# Altium schematic sheet USBPowerMux.SchDoc
size A; SheetNumber: 2; SheetTotal: 2; SPICEModelCacheGCPYIVAD: <root> / <DocumentId>GCPYIVAD</DocumentId> / <CacheFrame Number="0"> / <Model Name="inv_delay_basic_gen" Kind="CKT"> / <Text>*$ / .SUBCKT INV_DELAY_BASIC_GEN A  Y PARAMS: VDD=1 VSS=0 VTHRESH=0.5 DELAY = 10n / E_ABMGATE1    YINT1 0 VALUE {{IF(V(A) &gt; {VTHRESH} , / + {VDD},{VSS})}} / RINT YINT1 YINT2 1 / CINT YINT2 0 {DELAY*1.3} / E_ABMGATE2    YINT3 0 VALUE {{IF(V(YINT2) &gt; {VTHRESH} , / + {VSS},{VDD})}} / RINT2 YINT3 Y 1 / CINT2 Y 0 1n / .ENDS INV_DELAY_BASIC_GEN</Text> / </Model> / <Model Name="pmos01" Kind="MDL"> / <Text>*$ / .model PMOS01 pmos / + vto=-0.69 / + kp=1000 / + lambda=0.001</Text> / </Model> / <Model Name="dd" Kind="MDL"> / <Text>*$ / .model DD d / + is=1e-015 / + n=0.01 / + tt=1e-011</Text> / </Model> / <Model Name="rvar" Kind="CKT"> / <Text>*$ / .subckt rvar 101 102 201 202 Params: Rref=1 / rin 201 202 1G / r 301 0 {rref} / fcopy 0 301 vsense 1 / eout 101 106 poly(2) 201 202 301 0 0 0 0 0 1 / vsense 106 102 0 / .ends</Text> / </Model> / <Model Name="and2_basic_gen" Kind="CKT"> / <Text>*$ / .SUBCKT AND2_BASIC_GEN A B Y PARAMS: VDD=1 VSS=0 VTHRESH=0.5 / E_ABMGATE    YINT 0 VALUE {{IF(V(A) &gt; {VTHRESH}  &amp; / + V(B) &gt; {VTHRESH},{VDD},{VSS})}} / RINT YINT Y 1 / CINT Y 0 1n / .ENDS AND2_BASIC_GEN</Text> / </Model> / <Model Name="or2_basic_gen" Kind="CKT"> / <Text>*$ / .SUBCKT OR2_BASIC_GEN A B Y PARAMS: VDD=1 VSS=0 VTHRESH=0.5 / E_ABMGATE    YINT 0 VALUE {{IF(V(A) &gt; {VTHRESH}  | / + V(B) &gt; {VTHRESH},{VDD},{VSS})}} / RINT YINT Y 1 / CINT Y 0 1n / .ENDS OR2_BASIC_GEN</Text> / </Model> / <Model Name="channel_1_u1_s2" Kind="CKT"> / <Text>*$ / .subckt CHANNEL_1_U1_S2 1 2 3 4 / S_U1_S2         3 4 1 2 _U1_S2 / RS_U1_S2         1 2 1G / .MODEL         _U1_S2 VSWITCH Roff=1m Ron=1G Voff=0.2 Von=0.8 / .ends CHANNEL_1_U1_S2</Text> / </Model> / <Model Name="channel_1_u1_s1" Kind="CKT"> / <Text>*$ / .subckt CHANNEL_1_U1_S1 1 2 3 4 / S_U1_S1         3 4 1 2 _U1_S1 / RS_U1_S1         1 2 1G / .MODEL         _U1_S1 VSWITCH Roff=1m Ron=1G Voff=0.1 Von=0.8 / .ends CHANNEL_1_U1_S1</Text> / </Model> / <Model Name="buf_delay_basic_gen" Kind="CKT"> / <Text>*$ / .SUBCKT BUF_DELAY_BASIC_GEN A  Y PARAMS: VDD=1 VSS=0 VTHRESH=0.5 DELAY = 10n / E_ABMGATE1    YINT1 0 VALUE {{IF(V(A) &gt; {VTHRESH} , / + {VDD},{VSS})}} / RINT YINT1 YINT2 1 / CINT YINT2 0 {DELAY*1.3} / E_ABMGATE2    YINT3 0 VALUE {{IF(V(YINT2) &gt; {VTHRESH} , / + {VDD},{VSS})}} / RINT2 YINT3 Y 1 / CINT2 Y 0 1n / .ENDS BUF_DELAY_BASIC_GEN</Text> / </Model> / <Model Name="comphys_basic_gen" Kind="CKT"> / <Text>*$ / .SUBCKT COMPHYS_BASIC_GEN INP INM HYS OUT PARAMS: VDD=1 VSS=0 VTHRESH=0.5 / EIN INP1 INM1 INP INM 1 / EHYS INP1 INP2 VALUE { IF( V(1) &gt; {VTHRESH},-V(HYS),0) } / EOUT OUT 0 VALUE { IF( V(INP2)&gt;V(INM1), {VDD} ,{VSS}) } / R1 OUT 1 1 / C1 1 0 5n / RINP1 INP1 0 1K / .ENDS COMPHYS_BASIC_GEN</Text> / </Model> / <Model Name="mode_pr1_st_u3_s1" Kind="CKT"> / <Text>*$ / .subckt MODE_PR1_ST_U3_S1 1 2 3 4 / S_U3_S1         3 4 1 2 _U3_S1 / RS_U3_S1         1 2 1G / .MODEL         _U3_S1 VSWITCH Roff=53.3Meg Ron=100 Voff=0.8V Von=0.2V / .ends MODE_PR1_ST_U3_S1</Text> / </Model> / <Model Name="inv_basic_gen" Kind="CKT"> / <Text>*$ / .SUBCKT INV_BASIC_GEN A  Y PARAMS: VDD=1 VSS=0 VTHRESH=0.5 / E_ABMGATE    YINT 0 VALUE {{IF(V(A) &gt; {VTHRESH} , / + {VSS},{VDD})}} / RINT YINT Y 1 / CINT Y 0 1n / .ENDS INV_BASIC_GEN</Text> / </Model> / <Model Name="buf_basic_gen" Kind="CKT"> / <Text>*$ / .SUBCKT BUF_BASIC_GEN A  Y PARAMS: VDD=1 VSS=0 VTHRESH=0.5 / E_ABMGATE    YINT 0 VALUE {{IF(V(A) &gt; {VTHRESH} , / + {VDD},{VSS})}} / RINT YINT Y 1 / CINT Y 0 1n / .ENDS BUF_BASIC_GEN</Text> / </Model> / <Model Name="comp_basic_gen" Kind="CKT"> / <Text>*$ / .SUBCKT COMP_BASIC_GEN INP INM Y PARAMS: VDD=1 VSS=0 VTHRESH=0.5 / E_ABM Yint 0 VALUE {IF (V(INP) &gt; / + V(INM), {VDD},{VSS})} / R1 Yint Y 1 / C1 Y 0 1n / .ENDS COMP_BASIC_GEN</Text> / </Model> / <Model Name="srlatchrhp_basic_gen" Kind="CKT"> / <Text>*$ / .SUBCKT SRLATCHRHP_BASIC_GEN S R Q QB PARAMS: VDD=1 VSS=0 VTHRESH=0.5 / GQ 0 Qint VALUE = {IF(V(R) &gt; {VTHRESH},-5,IF(V(S)&gt;{VTHRESH},5, 0))} / CQint Qint 0 1n / RQint Qint 0 1000MEG / D_D10 Qint MY5 D_D1 / V1 MY5 0 {VDD} / D_D11 MYVSS Qint D_D1 / V2 MYVSS 0 {VSS} / EQ Qqq 0 Qint 0 1 / X3 Qqq Qqqd1 BUF_BASIC_GEN PARAMS: VDD={VDD} VSS={VSS} VTHRESH={VTHRESH} / RQq Qqqd1 Q 1 / EQb Qbr 0 VALUE = {IF( V(Q) &gt; {VTHRESH}, {VSS},{VDD})} / RQb Qbr QB 1 / Cdummy1 Q 0 1n / Cdummy2 QB 0 1n / .IC V(Qint) {VSS} / .model d_d1 d / + is=1e-015 / + tt=1e-011 / + rs=0.05 / + n=0.01 / .ENDS SRLATCHRHP_BASIC_GEN</Text> / <Dependency>0\buf_basic_gen</Dependency> / </Model> / <Model Name="and3_basic_gen" Kind="CKT"> / <Text>*$ / .SUBCKT AND3_BASIC_GEN A B C Y PARAMS: VDD=1 VSS=0 VTHRESH=0.5 / E_ABMGATE    YINT 0 VALUE {{IF(V(A) &gt; {VTHRESH}  &amp; / + V(B) &gt; {VTHRESH} &amp; / + V(C) &gt; {VTHRESH},{VDD},{VSS})}} / RINT YINT Y 1 / CINT Y 0 1n / .ENDS AND3_BASIC_GEN</Text> / </Model> / <Model Name="nor2_basic_gen" Kind="CKT"> / <Text>*$ / .SUBCKT NOR2_BASIC_GEN A B Y PARAMS: VDD=1 VSS=0 VTHRESH=0.5 / E_ABMGATE    YINT 0 VALUE {{IF(V(A) &gt; {VTHRESH}  | / + V(B) &gt; {VTHRESH},{VSS},{VDD})}} / RINT YINT Y 1 / CINT Y 0 1n / .ENDS NOR2_BASIC_GEN</Text> / </Model> / <Model Name="or3_basic_gen" Kind="CKT"> / <Text>*$ / .SUBCKT OR3_BASIC_GEN A B C Y PARAMS: VDD=1 VSS=0 VTHRESH=0.5 / E_ABMGATE    YINT 0 VALUE {{IF(V(A) &gt; {VTHRESH}  | / + V(B) &gt; {VTHRESH} | / + V(C) &gt; {VTHRESH},{VDD},{VSS})}} / RINT YINT Y 1 / CINT Y 0 1n / .ENDS OR3_BASIC_GEN</Text> / </Model> / <Model Name="one_shot" Kind="CKT"> / <Text>*$ / .SUBCKT ONE_SHOT IN OUT PARAMS:  T=100 / S_S1         MEAS 0 RESET2 0 S1 / E_ABM1         CH 0 VALUE { IF( V(IN)&gt;0.5 | V(OUT)&gt;0.5,1,0)    } / R_R2         RESET2 RESET  0.1 / E_ABM3         OUT 0 VALUE { IF( V(MEAS)&lt;0.5 &amp; V(CH)&gt;0.5,1,0)    } / R_R1         MEAS CH  {T} / C_C2         0 RESET2  1.4427N / C_C1         0 MEAS  1.4427N / E_ABM2         RESET 0 VALUE { IF(V(CH)&lt;0.5,1,0)    } / .MODEL S1 VSWITCH / + ROFF=1E+009 / + RON=1 / + VOFF=0.25 / + VON=0.75 / .ENDS ONE_SHOT</Text> / </Model> / <Model Name="channel_1_u7_s2" Kind="CKT"> / <Text>*$ / .subckt CHANNEL_1_U7_S2 1 2 3 4 / S_U7_S2         3 4 1 2 _U7_S2 / RS_U7_S2         1 2 1G / .MODEL         _U7_S2 VSWITCH Roff=1m Ron=1G Voff=0.2 Von=0.8 / .ends CHANNEL_1_U7_S2</Text> / </Model> / <Model Name="channel_1_u7_s1" Kind="CKT"> / <Text>*$ / .subckt CHANNEL_1_U7_S1 1 2 3 4 / S_U7_S1         3 4 1 2 _U7_S1 / RS_U7_S1         1 2 1G / .MODEL         _U7_S1 VSWITCH Roff=1m Ron=1G Voff=0.1 Von=0.8 / .ends CHANNEL_1_U7_S1</Text> / </Model> / <Model Name="tps2116_trans" Kind="CKT"> / <Text>*$ / * TPS2116 / ***************************************************************************** / * (C) Copyright 2021 Texas Instruments Incorporated. All rights reserved. / ***************************************************************************** / ** This model is designed as an aid for customers of Texas Instruments. / ** TI and its licensors and suppliers make no warranties, either expressed / ** or implied, with respect to this model, including the warranties of / ** merchantability or fitness for a particular purpose.  The model is / ** provided solely on an "as is" basis.  The entire risk as to its quality / ** and performance is with the customer / ***************************************************************************** / * / * This model is subject to change without notice. Texas Instruments / * Incorporated is not responsible for updating this model. / * / ***************************************************************************** / * / ** Released by: Texas Instruments Inc. / * Part: TPS2116 / * Date: 05MAY2021 / * Model Type: TRANSIENT / * Simulator: PSPICE / * Simulator Version: 17.2-2016 S074 / * EVM Order Number: TPS2116EVM / * EVM Users Guide: PSIL122 / * Datasheet: SLVSFG1 â€“ AUGUST 2019 / * / * Model Version: Final 1.10 / * / ***************************************************************************** / * / * Updates: / * / * Final 1.10 / * Following modifications are done in comparision to TPS2116 ver 1.0. / * 1. Diode mode functionality is removed / * 2. Switchover time values are updated / * 3. RON values are updated / * 4. Quiescent and standby current values are updated. Shutdown currents are removed / * 5. Soft-start and fast rise blocks are modified / * / * Final 1.00 / * Release to Web. / * / ***************************************************************************** / * / * Model Usage Notes: / * A. Features have been modelled / *	1. 	Turn-on switching characteristic / *	2. 	Switch over characteristic- Priority/Manual mode / *	3. 	Reverse current blocking / *	4. 	Quiescent Current and Standby Current / *	5. 	Ron Variation with VIN / *   6.  Status pin(ST) behaviour / * / * B. Features have not been modelled / *	1.  Temperature dependent characteristics / * / ***************************************************************************** / .SUBCKT  TPS2116_TRANS  GND MODE PR1 ST VIN1 VIN2 VOUT_0 VOUT_1 / D_U1_D8         VOUT_0 U1_SOURCE DD / D_U1_D9         GND U1_GATE_1 DD / D_U1_D7         U1_N16177224 U1_SOURCE DD / M_U1_HFET_1         VOUT_0 U1_GATE_1 U1_SOURCE U1_CLAMP PMOS01 / D_U1_D6         U1_GATE_1 U1_CLAMP DD / G_U1_G1         U1_CLAMP U1_GATE_1 U1_BFET_EN 0 1m / G_U1_G8         U1_GATE_1 GND TABLE { V(U1_N16194620, 0) } / + ( (0,0)(1.8,208n)(3.3,264n)(5.0,306n) ) / E_U1_ABM16         U1_N16194620 0 VALUE { IF(V(EN_GATE1) &gt; 0.5, V(VIN1),0)    } / C_U1_C4         VOUT_0 U1_GATE_1  130p  TC=0,0 / G_U1_G11         U1_GATE_1 GND FAST_RISE_1 0 100u / E_U1_ABM17         U1_CLAMP 0 VALUE { IF((V(VOUT_0) / + &gt;V(VIN1)),V(VOUT_0),V(VIN1))   } / X_U1_U7         U1_N16680056 U1_N16177224 U1_ON_RES1 0 RVAR PARAMS:  RREF=1 / X_U1_U59         U1_N16678010 EN_CH1 U1_N16678042 AND2_BASIC_GEN PARAMS: VDD=1 / +  VSS=0 VTHRESH=500E-3 / X_U1_S2    U1_BFET_EN 0 U1_N16177224 U1_SOURCE CHANNEL_1_U1_S2 / V_U1_V2         U1_N16184706 0 25m / V_U1_V1         U1_N16184645 VIN1_INT 42m / X_U1_U57         FAST_RISE_1 EN_GATE1 U1_N16678010 OR2_BASIC_GEN PARAMS: VDD=1 / +  VSS=0 VTHRESH=500E-3 / X_U1_S1    RCB_1 0 VIN1 U1_N16680056 CHANNEL_1_U1_S1 / E_U1_E2         U1_N16679358 0 TABLE { V(VIN1_INT, 0) } / + ( (0,0)(1.6,39m)(1.8,38m)(3.3,38m)(4,35m) ) / X_U1_U58         U1_N16678042 U1_BFET_EN INV_DELAY_BASIC_GEN PARAMS: VDD=1 / +  VSS=0 VTHRESH=0.5 DELAY=200n / C_U1_C11         0 U1_ON_RES1  1n / X_U1_U3         U1_N16185653 RCB_1 BUF_DELAY_BASIC_GEN PARAMS: VDD=1 VSS=0 / +  VTHRESH=0.5 DELAY=2u / X_U1_U2         VOUT_INT U1_N16184645 U1_N16184706 U1_N16185653 / +  COMPHYS_BASIC_GEN PARAMS: VDD=1 VSS=0 VTHRESH=0.5 / R_U1_R6         U1_N16679358 U1_ON_RES1  10 TC=0,0 / R_R1         VOUT_1 VOUT_0  1m TC=0,0 / X_U3_U8         U3_MODE_SEL U3_N16179076 U3_N16690215 AND2_BASIC_GEN PARAMS: / +  VDD=1 VSS=0 VTHRESH=500E-3 / V_U3_V3         U3_N16178390 0 1 / V_U3_V4         U3_N16178468 0 22m / X_U3_U1         MODE_INT U3_N16691574 U3_N16178252 U3_MODE_SEL / +  COMPHYS_BASIC_GEN PARAMS: VDD=1 VSS=0 VTHRESH=0.5 / X_U3_U2         PR1_INT U3_N16178390 U3_N16178468 U3_PR1_SEL COMPHYS_BASIC_GEN / +  PARAMS: VDD=1 VSS=0 VTHRESH=0.5 / V_U3_V2         U3_N16178252 0 100m / D_U3_D8         0 U3_N16684426 DD / X_U3_S1    U3_N16686667 0 ST 0 MODE_PR1_ST_U3_S1 / X_U3_U73         EN_CH2 U3_N16683632 INV_BASIC_GEN PARAMS: VDD=1 VSS=0 / +  VTHRESH=500E-3 / X_U3_U75         U3_N16684426 U3_SWITCH_OVER_DELAY_2 BUF_BASIC_GEN PARAMS: / +  VDD=1 VSS=0 VTHRESH=0.5 / E_U3_ABM7         U3_N166830931 0 VALUE { IF(V(U3_N16683632) &gt; 0.5, / +  V(VIN1_INT),0)    } / V_U3_V6         U3_N16181467 0 1.59 / E_U3_ABM8         U3_N166843121 0 VALUE { IF(V(U3_N16684336) &gt; 0.5, / +  V(VIN2_INT),0)    } / C_U3_C5         0 U3_N16683195  1n IC=0 / C_U3_C4         0 U3_N16683157  1n / X_U3_U18         VIN1_INT U3_N16181467 IN1_OK COMP_BASIC_GEN PARAMS: VDD=1 / +  VSS=0 VTHRESH=0.5 / X_U3_U14         U3_N16686181 U3_N16686667 BUF_DELAY_BASIC_GEN PARAMS: VDD=1 / +  VSS=0 VTHRESH=0.5 DELAY=5u / R_U3_R3         U3_N166830931 U3_N16683157  10 TC=0,0 / X_U3_U78         EN_CH1 U3_N16686162 U3_N16686181 N16686185 / +  SRLATCHRHP_BASIC_GEN PARAMS: VDD=1 VSS=0 VTHRESH=0.5 / C_U3_C7         0 U3_N16684426  1n IC=0 / D_U3_D5         U3_N16683195 U3_N16683065 DD / C_U3_C6         0 U3_N16684388  1n / X_U3_U24         U3_N16689992 IN1_OK U3_SWITCH_OVER_DELAY_1 EN_CH1 / +  AND3_BASIC_GEN PARAMS: VDD=1 VSS=0 VTHRESH=500E-3 / G_U3_G12         U3_N16683195 0 EN_CH2 0 100m / R_U3_R4         U3_N166843121 U3_N16684388  10 TC=0,0 / V_U3_V14         U3_N16684262 0 0.6 / X_U3_U19         VIN2_INT U3_N16181621 IN2_OK COMP_BASIC_GEN PARAMS: VDD=1 / +  VSS=0 VTHRESH=0.5 / D_U3_D7         U3_N16684426 U3_N16684262 DD / G_U3_G11         U3_N16683065 U3_N16683195 TABLE { V(U3_N16683157, 0) } / + ( (0,0) (1.8,30u) (3.3,100u)(5,80u) ) / X_U3_U27         U3_N16690215 IN2_OK U3_SWITCH_OVER_DELAY_2 EN_CH2 / +  AND3_BASIC_GEN PARAMS: VDD=1 VSS=0 VTHRESH=500E-3 / G_U3_G14         U3_N16684426 0 EN_CH1 0 100m / V_U3_V13         U3_N16683065 0 0.6 / X_U3_U87         IN2_OK EN_CH1 U3_N16688062 NOR2_BASIC_GEN PARAMS: VDD=1 VSS=0 / +  VTHRESH=500E-3 / G_U3_G13         U3_N16684262 U3_N16684426 TABLE { V(U3_N16684388, 0) } / + ( (0,0) (1.8,30u) (3.3,100u)(5,80u) ) / D_U3_D6         0 U3_N16683195 DD / X_U3_U72         U3_N16683195 U3_SWITCH_OVER_DELAY_1 BUF_BASIC_GEN PARAMS: / +  VDD=1 VSS=0 VTHRESH=0.5 / V_U3_V7         U3_N16181621 0 1.59 / X_U3_U74         EN_CH1 U3_N16684336 INV_BASIC_GEN PARAMS: VDD=1 VSS=0 / +  VTHRESH=500E-3 / V_U3_V15         U3_N16691368 0 0.1 / V_U3_V1         U3_N16691574 0 1 / X_U3_U90         U3_PR1_SEL U3_N16179076 INV_BASIC_GEN PARAMS: VDD=1 VSS=0 / +  VTHRESH=500E-3 / X_U3_U91         EN_CH2 RCB_1 U3_N16688062 U3_N16686162 OR3_BASIC_GEN PARAMS: / +  VDD=1 VSS=0 VTHRESH=500E-3 / X_U3_U89         U3_MODE_SEL U3_PR1_SEL U3_N16689992 AND2_BASIC_GEN PARAMS: / +  VDD=1 VSS=0 VTHRESH=500E-3 / V_U3_V16         U3_N16693410 0 1 / E_U3_E1         U3_N16691252 0 VIN1_INT VIN2_INT 1 / X_U3_U92         U3_N16691252 U3_N16691368 U3_N16693410 CH1_SEL / +  COMPHYS_BASIC_GEN PARAMS: VDD=1 VSS=0 VTHRESH=0.5 / E_E1         VIN1_INT 0 VIN1 GND 1 / E_E2         VIN2_INT 0 VIN2 GND 1 / E_E3         MODE_INT 0 MODE GND 1 / E_E4         PR1_INT 0 PR1 GND 1 / E_E5         VOUT_INT 0 VOUT_0 GND 1 / V_U4_V14         U4_N16719653 0 1m / X_U4_U101         U4_N16719969 U4_N16719905 ONE_SHOT PARAMS:  T=100 / C_U4_C1         0 U4_N16720367  1u IC=0 / V_U4_V15         U4_N16719361 0 1 / X_U4_U102         U4_N16719811 U4_N16719905 U4_N16719659 OR2_BASIC_GEN PARAMS: / +  VDD=1 VSS=0 VTHRESH=500E-3 / X_U4_U86         EN_CH1 U4_N16719805 INV_BASIC_GEN PARAMS: VDD=1 VSS=0 / +  VTHRESH=500E-3 / E_U4_ABM6         U4_N167201631 0 VALUE { IF(V(U4_POWER_UP_1) &gt; 0.5, / +  V(VIN1_INT),0)    } / V_U4_V16         U4_N16720095 0 0.51 / G_U4_G12         U4_N16720339 0 U4_N16720719 0 100m / G_U4_G3         U4_N16720099 U4_N16720367 TABLE { V(U4_N16720301, 0) } / + ( (0,0) (1.8,600u) (3.3,725u)(5,1m) ) / D_U4_D4         0 U4_N16720367 DD / X_U4_U97         EN_CH1 U4_N16719555 U4_POWER_UP_1 AND2_BASIC_GEN PARAMS: VDD=1 / +  VSS=0 VTHRESH=500E-3 / C_U4_C7         0 U4_N16720283  1n / V_U4_V5         U4_N16720099 0 0.51 / X_U4_U88         U4_N16719805 U4_N16719811 ONE_SHOT PARAMS:  T=100 / R_U4_R5         U4_N167201451 U4_N16720283  10 TC=0,0 / X_U4_U91         U4_N16719429 U4_N16719659 U4_N16719555 U4_N16719669 / +  SRLATCHRHP_BASIC_GEN PARAMS: VDD=1 VSS=0 VTHRESH=0.5 / X_U4_U104         U4_N16719669 EN_CH2 FAST_RISE_2 AND2_BASIC_GEN PARAMS: VDD=1 / +  VSS=0 VTHRESH=500E-3 / G_U4_G10         U4_N16720367 0 U4_N16720759 0 100m / D_U4_D5         U4_N16720339 U4_N16720095 DD / X_U4_U95         U4_N16719669 EN_CH1 FAST_RISE_1 AND2_BASIC_GEN PARAMS: VDD=1 / +  VSS=0 VTHRESH=500E-3 / X_U4_U105         U4_N16720339 EN_GATE2 BUF_BASIC_GEN PARAMS: VDD=1 VSS=0 / +  VTHRESH=0.5 / X_U4_U92         U4_N16719361 VOUT_INT U4_N16719367 COMP_BASIC_GEN PARAMS: / +  VDD=1 VSS=0 VTHRESH=0.5 / X_U4_U94         U4_N16719373 U4_N16719451 U4_N16719429 OR2_BASIC_GEN PARAMS: / +  VDD=1 VSS=0 VTHRESH=500E-3 / X_U4_U84         VOUT_INT U4_N16719653 U4_N16719601 COMP_BASIC_GEN PARAMS: / +  VDD=1 VSS=0 VTHRESH=0.5 / C_U4_C8         0 U4_N16720339  1u IC=0 / G_U4_G11         U4_N16720095 U4_N16720339 TABLE { V(U4_N16720283, 0) } / + ( (0,0) (1.8,600u) (3.3,725u)(5,1m) ) / C_U4_C3         0 U4_N16720301  1n / X_U4_U106         EN_CH2 U4_N16720719 INV_BASIC_GEN PARAMS: VDD=1 VSS=0 / +  VTHRESH=500E-3 / X_U4_U100         EN_CH2 U4_N16719969 INV_BASIC_GEN PARAMS: VDD=1 VSS=0 / +  VTHRESH=500E-3 / X_U4_U43         U4_N16720367 EN_GATE1 BUF_BASIC_GEN PARAMS: VDD=1 VSS=0 / +  VTHRESH=0.5 / D_U4_D6         0 U4_N16720339 DD / X_U4_U93         U4_N16719367 U4_N16719373 ONE_SHOT PARAMS:  T=100 / X_U4_U103         EN_CH2 U4_N16719555 U4_POWER_UP_2 AND2_BASIC_GEN PARAMS: / +  VDD=1 VSS=0 VTHRESH=500E-3 / D_U4_D3         U4_N16720367 U4_N16720099 DD / X_U4_U99         EN_CH1 U4_N16720759 INV_BASIC_GEN PARAMS: VDD=1 VSS=0 / +  VTHRESH=500E-3 / R_U4_R2         U4_N167201631 U4_N16720301  10 TC=0,0 / E_U4_ABM7         U4_N167201451 0 VALUE { IF(V(U4_POWER_UP_2) &gt; 0.5, / +  V(VIN2_INT),0)    } / X_U4_U85         U4_N16719601 U4_N16719451 ONE_SHOT PARAMS:  T=100 / X_U6_U1         EN_CH1 CH1_SEL U6_N16669985 AND2_BASIC_GEN PARAMS: VDD=1 VSS=0 / +  VTHRESH=500E-3 / G_U6_G7         VIN1 GND U6_N16672314 0 1.32u / X_U6_U9         CH1_SEL U6_N16671249 INV_BASIC_GEN PARAMS: VDD=1 VSS=0 / +  VTHRESH=500E-3 / X_U6_U12         CH1_SEL U6_N16672366 INV_BASIC_GEN PARAMS: VDD=1 VSS=0 / +  VTHRESH=500E-3 / X_U6_U5         EN_CH2 U6_N16671900 U6_N16671860 AND2_BASIC_GEN PARAMS: VDD=1 / +  VSS=0 VTHRESH=500E-3 / G_U6_G6         VIN2 GND U6_N16671209 0 1.35u / G_U6_G8         VIN1 GND U6_N16672326 0 0.3u / G_U6_G3         VIN1 GND U6_N16671848 0 1.1u / X_U6_U6         CH1_SEL U6_N16671900 INV_BASIC_GEN PARAMS: VDD=1 VSS=0 / +  VTHRESH=500E-3 / X_U6_U3         CH1_SEL U6_N16670318 INV_BASIC_GEN PARAMS: VDD=1 VSS=0 / +  VTHRESH=500E-3 / X_U6_U7         EN_CH2 CH1_SEL U6_N16671197 AND2_BASIC_GEN PARAMS: VDD=1 VSS=0 / +  VTHRESH=500E-3 / X_U6_U2         EN_CH1 U6_N16670318 U6_N16670140 AND2_BASIC_GEN PARAMS: VDD=1 / +  VSS=0 VTHRESH=500E-3 / X_U6_U10         EN_CH1 CH1_SEL U6_N16672314 AND2_BASIC_GEN PARAMS: VDD=1 VSS=0 / +  VTHRESH=500E-3 / G_U6_G4         VIN1 GND U6_N16671860 0 0.22u / X_U6_U8         EN_CH2 U6_N16671249 U6_N16671209 AND2_BASIC_GEN PARAMS: VDD=1 / +  VSS=0 VTHRESH=500E-3 / G_U6_G1         VIN2 GND U6_N16669985 0 0.05u / X_U6_U11         EN_CH1 U6_N16672366 U6_N16672326 AND2_BASIC_GEN PARAMS: VDD=1 / +  VSS=0 VTHRESH=500E-3 / G_U6_G2         VIN2 GND U6_N16670140 0 1.2u / X_U6_U4         EN_CH2 CH1_SEL U6_N16671848 AND2_BASIC_GEN PARAMS: VDD=1 VSS=0 / +  VTHRESH=500E-3 / G_U6_G5         VIN2 GND U6_N16671197 0 0.1u / E_U7_ABM16         U7_N16194620 0 VALUE { IF(V(EN_GATE2) &gt; 0.5, V(VIN2),0)    } / D_U7_D7         U7_N16177224 U7_SOURCE DD / C_U7_C4         VOUT_0 U7_GATE_1  130p  TC=0,0 / D_U7_D8         VOUT_0 U7_SOURCE DD / G_U7_G11         U7_GATE_1 GND FAST_RISE_2 0 100u / E_U7_ABM17         U7_CLAMP 0 VALUE { IF((V(VOUT_0) / + &gt;V(VIN2)),V(VOUT_0),V(VIN2))   } / X_U7_U7         U7_N16680056 U7_N16177224 U7_ON_RES1 0 RVAR PARAMS:  RREF=1 / X_U7_U59         U7_N16678010 EN_CH2 U7_N16678042 AND2_BASIC_GEN PARAMS: VDD=1 / +  VSS=0 VTHRESH=500E-3 / X_U7_S2    U7_BFET_EN 0 U7_N16177224 U7_SOURCE CHANNEL_1_U7_S2 / V_U7_V2         U7_N16184706 0 25m / M_U7_HFET_1         VOUT_0 U7_GATE_1 U7_SOURCE U7_CLAMP PMOS01 / V_U7_V1         U7_N16184645 VIN2_INT 42m / X_U7_U57         FAST_RISE_2 EN_GATE2 U7_N16678010 OR2_BASIC_GEN PARAMS: VDD=1 / +  VSS=0 VTHRESH=500E-3 / X_U7_S1    RCB_2 0 VIN2 U7_N16680056 CHANNEL_1_U7_S1 / D_U7_D9         GND U7_GATE_1 DD / E_U7_E2         U7_N16679358 0 TABLE { V(VIN2_INT, 0) } / + ( (0,0)(1.6,39m)(1.8,38m)(3.3,38m)(4,35m) ) / X_U7_U58         U7_N16678042 U7_BFET_EN INV_DELAY_BASIC_GEN PARAMS: VDD=1 / +  VSS=0 VTHRESH=0.5 DELAY=200n / C_U7_C11         0 U7_ON_RES1  1n / X_U7_U3         U7_N16185653 RCB_2 BUF_DELAY_BASIC_GEN PARAMS: VDD=1 VSS=0 / +  VTHRESH=0.5 DELAY=2u / G_U7_G1         U7_CLAMP U7_GATE_1 U7_BFET_EN 0 1m / D_U7_D6         U7_GATE_1 U7_CLAMP DD / X_U7_U2         VOUT_INT U7_N16184645 U7_N16184706 U7_N16185653 / +  COMPHYS_BASIC_GEN PARAMS: VDD=1 VSS=0 VTHRESH=0.5 / R_U7_R6         U7_N16679358 U7_ON_RES1  10 TC=0,0 / G_U7_G8         U7_GATE_1 GND TABLE { V(U7_N16194620, 0) } / + ( (0,0)(1.8,208n)(3.3,264n)(5.0,306n) ) / .ENDS   TPS2116_TRANS</Text> / <Dependency>0\inv_delay_basic_gen</Dependency> / <Dependency>0\pmos01</Dependency> / <Dependency>0\dd</Dependency> / <Dependency>0\rvar</Dependency> / <Dependency>0\and2_basic_gen</Dependency> / <Dependency>0\or2_basic_gen</Dependency> / <Dependency>0\channel_1_u1_s2</Dependency> / <Dependency>0\channel_1_u1_s1</Dependency> / <Dependency>0\buf_delay_basic_gen</Dependency> / <Dependency>0\comphys_basic_gen</Dependency> / <Dependency>0\mode_pr1_st_u3_s1</Dependency> / <Dependency>0\inv_basic_gen</Dependency> / <Dependency>0\buf_basic_gen</Dependency> / <Dependency>0\comp_basic_gen</Dependency> / <Dependency>0\srlatchrhp_basic_gen</Dependency> / <Dependency>0\and3_basic_gen</Dependency> / <Dependency>0\nor2_basic_gen</Dependency> / <Dependency>0\or3_basic_gen</Dependency> / <Dependency>0\one_shot</Dependency> / <Dependency>0\channel_1_u7_s2</Dependency> / <Dependency>0\channel_1_u7_s1</Dependency> / </Model> / </CacheFrame> / </root>
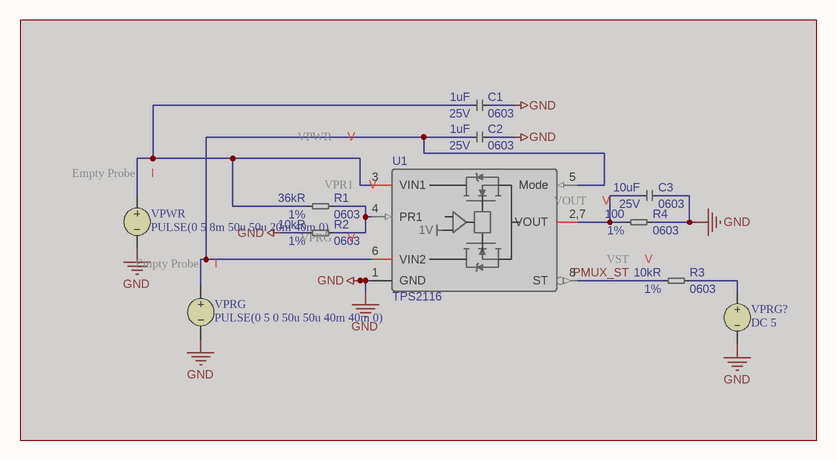
[diagram p0: USBPowerMux.SchDoc]

## Parts
C1  value 1uF  Voltage - Rated: 25V  Package/Case Imperial: 0603  [CAPACITOR_0603(1608)_GENERIC]  (hidden comment: Capacitor - Ceramic - Generic)  (masked out: inside a compile mask, not in the netlist)
C2  value 1uF  Voltage - Rated: 25V  Package/Case Imperial: 0603  [CAPACITOR_0603(1608)_GENERIC]  (hidden comment: Capacitor - Ceramic - Generic)  (masked out: inside a compile mask, not in the netlist)
C3  value 10uF  Voltage - Rated: 25V  Package/Case Imperial: 0603  [CAPACITOR_0603(1608)_GENERIC]  (hidden comment: Capacitor - Ceramic - Generic)  (masked out: inside a compile mask, not in the netlist)
R1  value 36kR  Tolerance: 1%  Package/Case Imperial: 0603  [RESISTOR_0603(1608)_GENERIC]  (hidden comment: Resistor - Fixed - Generic)  (masked out: inside a compile mask, not in the netlist)
R2  value 10kR  Tolerance: 1%  Package/Case Imperial: 0603  [RESISTOR_0603(1608)_GENERIC]  (hidden comment: Resistor - Fixed - Generic)  (masked out: inside a compile mask, not in the netlist)
R3  value 10kR  Tolerance: 1%  Package/Case Imperial: 0603  [RESISTOR_0603(1608)_GENERIC]  (hidden comment: Resistor - Fixed - Generic)  (masked out: inside a compile mask, not in the netlist)
R4  value 100  Tolerance: 1%  Package/Case Imperial: 0603  [RESISTOR_0603(1608)_GENERIC]  (hidden comment: Resistor - Fixed - Generic)  (masked out: inside a compile mask, not in the netlist)
U1  TPS2116  [SOT-583(DRL0008A)_TI]  (masked out: inside a compile mask, not in the netlist)
VPRG  PULSE(0 5 0 50u 50u 40m 40m 0)  (masked out: inside a compile mask, not in the netlist)
VPRG?  DC 5  (masked out: inside a compile mask, not in the netlist)
VPWR  PULSE(0 5 8m 50u 50u 20m 40m 0)  (masked out: inside a compile mask, not in the netlist)

## Notes on the sheet
- (in symbol IC - Power Management - Mux - TI TPS2116) 1V

## Library data of the parts
C1-C3 = CAP-CER_1UF_25V_20%_X7R_0603(1608): 1uF ±20% 25V Ceramic Capacitor X7R 0603(1608 Metric); Manufacturer 1: Murata Electronics; Manufacturer Part Number 1: GCM188R71E105KA64D; Manufacturer Lifecycle 1: Active; Package/Case Metric: 1608; Name: CAP-CER_1UF_25V_20%_X7R_0603(1608); Item: CAP-CER; Temperature Coefficient: X7R; Tolerance: 20%; Mounting Type: SMT; Full Item: Ceramic Capacitor; Manufacturer 2: Murata Electronics; Manufacturer Part Number 2: GCM188R71E105KA64J; Manufacturer Lifecycle 2: Active; Manufacturer 3: Murata Electronics; Manufacturer Part Number 3: GCM188R71E105MA64D; Manufacturer Lifecycle 3: Active
R1 = RES-FXD_36KR_1%_100MW_100PPM/°C_0603(1608): 36kR ±1% 100mW Chip Resistor 100ppm/°C 0603(1608 Metric); Manufacturer 1: Bourns Inc.; Manufacturer Part Number 1: CR0603-FX-3602ELF; Manufacturer Lifecycle 1: Active; Package/Case Metric: 1608; Name: RES-FXD_36KR_1%_100MW_100PPM/°C_0603(1608); Item: RES-FXD; Temperature Coefficient: 100ppm/°C; Power: 100mW; Mounting Type: SMT; Full Item: Chip Resistor
R2-R4 = RES-FXD_10KR_1%_100MW_100PPM/°C_0603(1608): 10kR ±1% 100mW Chip Resistor 100ppm/°C 0603(1608 Metric); Manufacturer 1: Bourns Inc.; Manufacturer Part Number 1: CR0603-FX-1002ELF; Manufacturer Lifecycle 1: Active; Package/Case Metric: 1608; Name: RES-FXD_10KR_1%_100MW_100PPM/°C_0603(1608); Item: RES-FXD; Temperature Coefficient: 100ppm/°C; Power: 100mW; Mounting Type: SMT; Full Item: Chip Resistor; Manufacturer 2: Bourns Inc.; Manufacturer Part Number 2: CR0603AFX-1002EAS; Manufacturer Lifecycle 2: Active; Manufacturer 3: Bourns Inc.; Manufacturer Part Number 3: CMP0603-FX-1002ELF; Manufacturer Lifecycle 3: Active
U1 = IC - Power Management - Mux - TI TPS2116: Supplier 1: Mouser; Supplier Part Number 1: 595-TPS2116DRLR; Supplier 2: Texas Instruments; Supplier Part Number 2: TPS2116DRLR; Supplier 3: Digi-Key; Supplier Part Number 3: 296-TPS2116DRLRCT-ND; Supplier 4: Digi-Key; Supplier Part Number 4: 296-TPS2116DRLRDKR-ND
VPRG VPWR = VSRC: Voltage Source; Note: PCB Footprint - Not required; AC Magnitude: 1; AC Phase: 0; DC Magnitude: 5; Published: 8-Jun-2000; LatestRevisionDate: 17-Jul-2002; LatestRevisionNote: Re-released for DXP Platform.; PackageReference: Not Applicable; Publisher: Altium Limited; Initial Value: 0; Pulsed Value: 5; Rise Time: 50u; Fall Time: 50u; Period: 40m; Phase: 0
  VPRG: Time Delay: 0; Pulse Width: 40m
  VPWR: Time Delay: 8m; Pulse Width: 20m
VPRG? = VSRC: Voltage Source; Note: PCB Footprint - Not required; AC Magnitude: 1; AC Phase: 0; Value: 5; Published: 8-Jun-2000; LatestRevisionDate: 17-Jul-2002; LatestRevisionNote: Re-released for DXP Platform.; PackageReference: Not Applicable; Publisher: Altium Limited